# EAGLE design bridge (EAGLE 6.5.0)
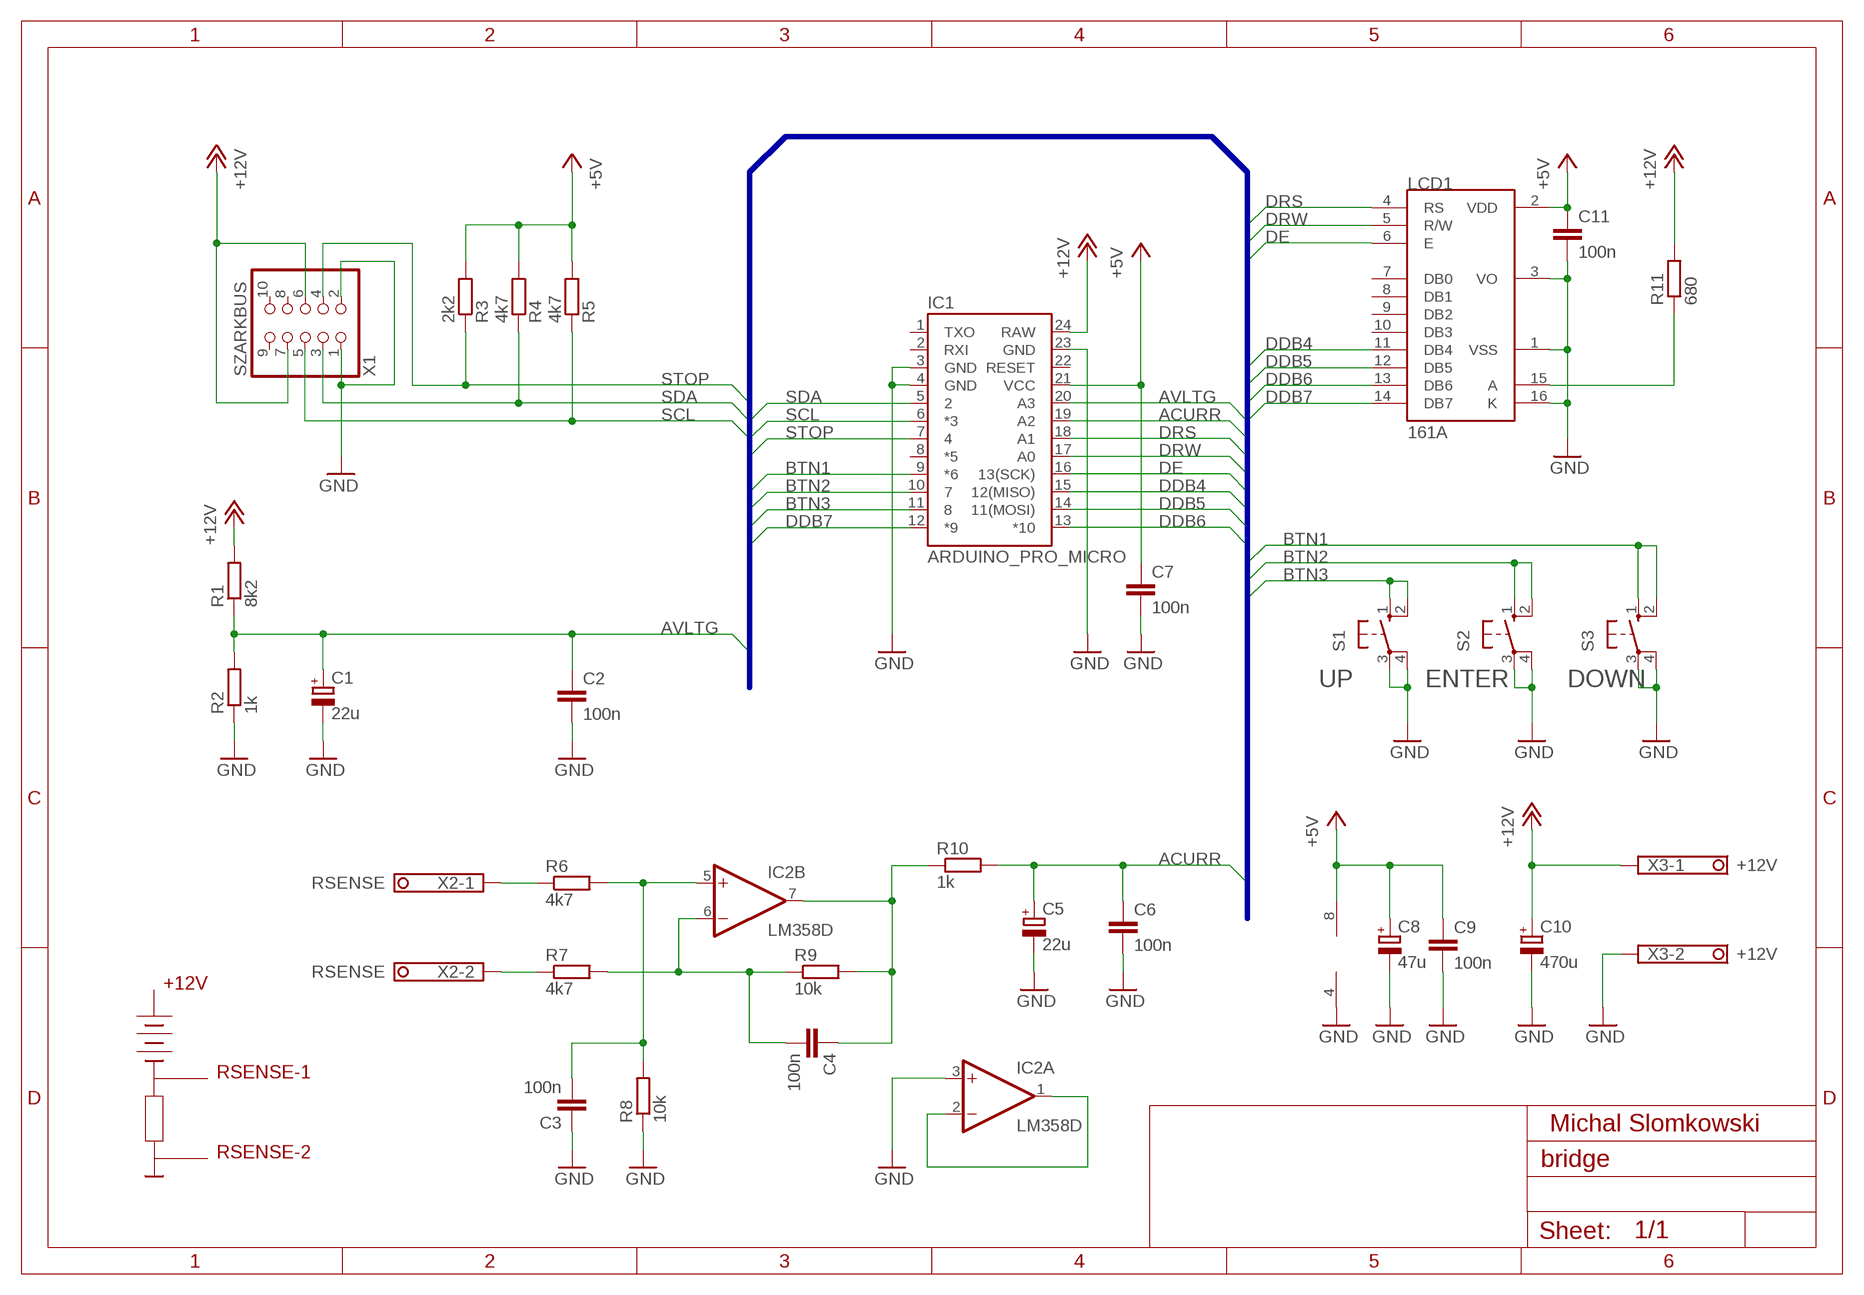
[diagram p0: schematic, sheet 1]

## Parts
C1  22u  CPOL-EUB/3528-21W  [B/3528-21W]
C2  100n  C-EUC1206  [C1206]
C3  100n  C-EUC1210  [C1210]
C4  100n  C-EUC1206  [C1206]
C5  22u  CPOL-EUB/3528-21W  [B/3528-21W]
C6  100n  C-EUC1206  [C1206]
C7  100n  C-EUC1206  [C1206]
C8  47u  CPOL-EUC/6032-28W  [C/6032-28W]
C9  100n  C-EUC1206  [C1206]
C10  470u  CPOL-EUE5-8.5  [E5-8,5]
C11  100n  C-EUC1206  [C1206]
IC1  ARDUINO_PRO_MICRO  [ARDUINO_PRO_MICRO]
IC2  LM358D  [SO08]
LCD1  161A  [161A]
R1  8k2  R-EU_M1206  [M1206]
R2  1k  R-EU_M1206  [M1206]
R3  2k2  R-EU_M1206  [M1206]
R4  4k7  R-EU_M1206  [M1206]
R5  4k7  R-EU_M1206  [M1206]
R6  4k7  R-EU_M1206  [M1206]
R7  4k7  R-EU_M1206  [M1206]
R8  10k  R-EU_M1206  [M1206]
R9  10k  R-EU_M1206  [M1206]
R10  1k  R-EU_M1206  [M1206]
R11  680  R-EU_0207/12  [0207/12]
S1  10-XX  [B3F-10XX]
S2  10-XX  [B3F-10XX]
S3  10-XX  [B3F-10XX]
X1  SZARKBUS  PINHD-2X5  [2X05]
X2  RSENSE  1751248  [1751248]
X3  +12V  1751248  [1751248]

## Nets
+5V: C7.1 C8.+ C9.1 C11.1 IC1.21(VCC) IC2.8(P:V+) LCD1.2(VDD) R3.2 R4.2 R5.2
+12V: C10.+ IC1.24(RAW) R1.2 R11.2 X1.6 X1.7 X3.1
ACURR: C5.+ C6.1 IC1.19(A2) R10.2
AVLTG: C1.+ C2.1 IC1.20(A3) R1.1 R2.2
BTN1: IC1.9(*6) S3.1(S) S3.2(S1)
BTN2: IC1.10 S2.1(S) S2.2(S1)
BTN3: IC1.11 S1.1(S) S1.2(S1)
DDB4: IC1.15(12(MISO)) LCD1.11(DB4)
DDB5: IC1.14(11(MOSI)) LCD1.12(DB5)
DDB6: IC1.13(*10) LCD1.13(DB6)
DDB7: IC1.12(*9) LCD1.14(DB7)
DE: IC1.16(13(SCK)) LCD1.6(E)
DRS: IC1.18(A1) LCD1.4(RS)
DRW: IC1.17(A0) LCD1.5(R/W)
GND: C1.- C2.2 C3.1 C5.- C6.2 C7.2 C8.- C9.2 C10.- C11.2 IC1.3(GND) IC1.4(GND) IC1.23(GND) IC2.3(A:+IN) IC2.4(P:V-) LCD1.1(VSS) LCD1.3(VO) LCD1.16(K) R2.1 R8.1 S1.3(P) S1.4(P1) S2.3(P) S2.4(P1) S3.3(P) S3.4(P1) X1.1 X1.2 X3.2
N$1: C3.2 IC2.5(B:+IN) R6.2 R8.2
N$2: LCD1.15(A) R11.1
N$4: C4.2 IC2.6(B:-IN) R7.2 R9.1
N$12: IC2.1(A:OUT) IC2.2(A:-IN)
N$21: R7.1 X2.2
N$29: R6.1 X2.1
NET3: C4.1 IC2.7(B:OUT) R9.2 R10.1
SCL: IC1.6(*3) R5.1 X1.5
SDA: IC1.5 R4.1 X1.3
STOP: IC1.7 R3.1 X1.4
Unconnected: IC1.1(TXO) IC1.2(RXI) IC1.8(*5) IC1.22(RESET) LCD1.7(DB0) LCD1.8(DB1) LCD1.9(DB2) LCD1.10(DB3) X1.8 X1.9 X1.10

## Buses
B$1

## Notes on the sheet
- UP | ENTER | DOWN
- +12V
- RSENSE-1
- Michal Slomkowski
- RSENSE-2

## Library data of the parts
C1 C5 C8 C10 = rcl:CPOL-EU: POLARIZED CAPACITOR, European symbol
C2-C4 C6 C7 C9 C11 = rcl:C-EU: CAPACITOR, European symbol
IC1 = sparkfun-boards:ARDUINO_PRO_MICRO
IC2 = linear:LM358: OP AMP also LM158; LM258; LM2904 Source: http://cache.national.com/ds/LM/LM158.pdf
LCD1 = robot:161A
R1-R11 = rcl:R-EU_: RESISTOR, European symbol
S1-S3 = switch-omron:10-XX: OMRON SWITCH; MPN: B3F-1000; OC_FARNELL: 176432; OC_NEWARK: 36M3542
X1 = pinhead:PINHD-2X5: PIN HEADER
X2 X3 = con-phoenix-350:1751248: MKDS 1/ 2-3,5 Printklemme Nennstrom: 10 A Bemessungsspannung: 160 V Raster: 3,5 mm Polzahl: 2 Montageart: Löten Anschlussart: Schraubanschluss Anschlussrichtung vom Leiter zur Platine: 0° Source: http://eshop.phoenixcontact.com .. 1751248.pdf; OC_FARNELL: unknown; OC_NEWARK: unknown

## Board
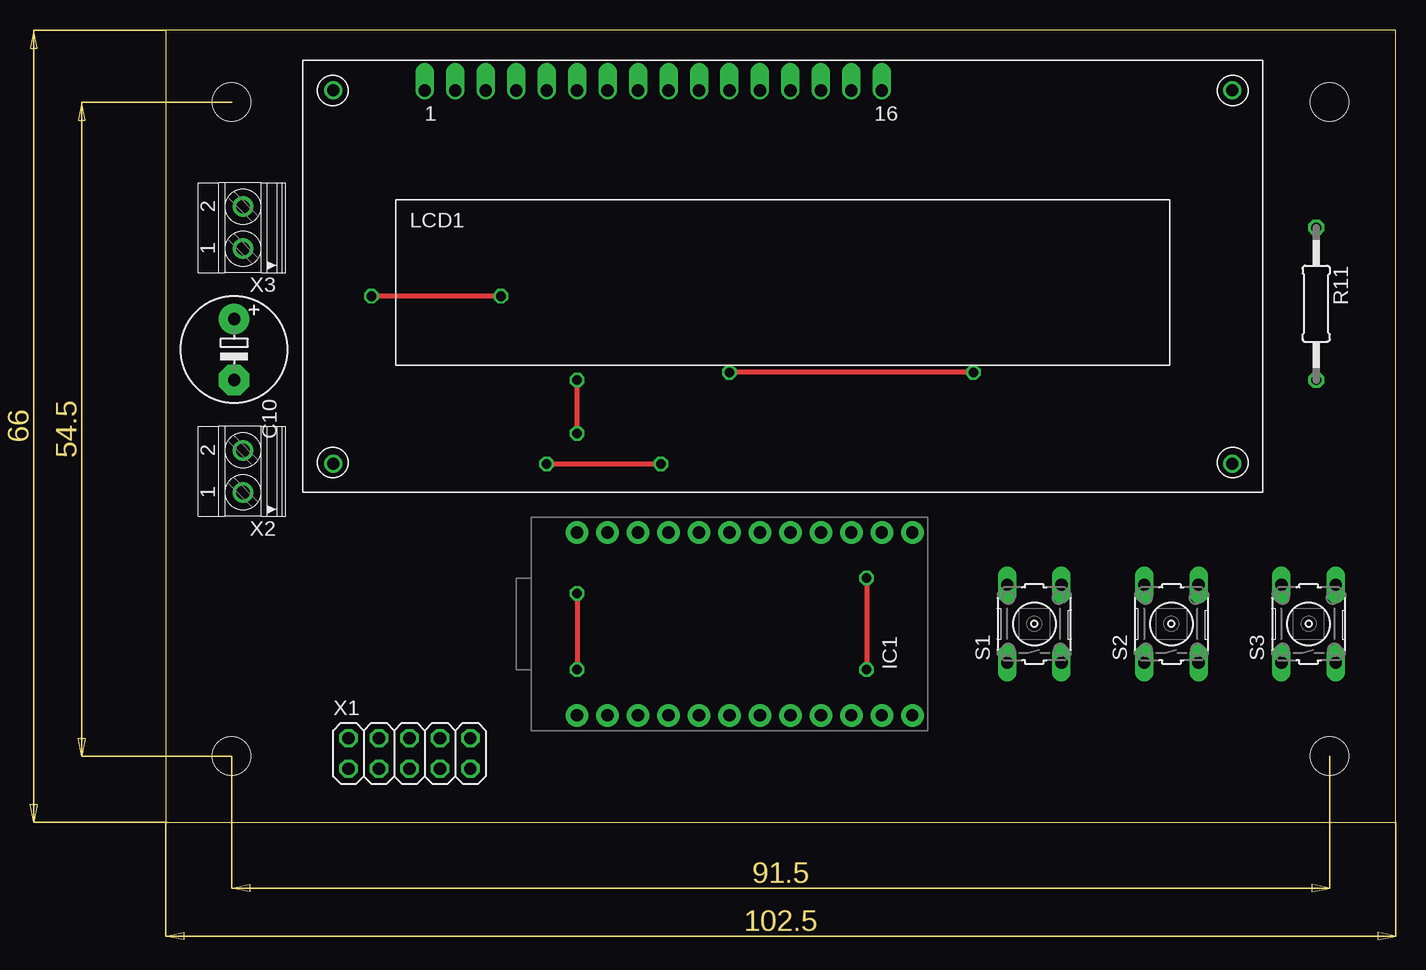
[diagram p1: board, top side]
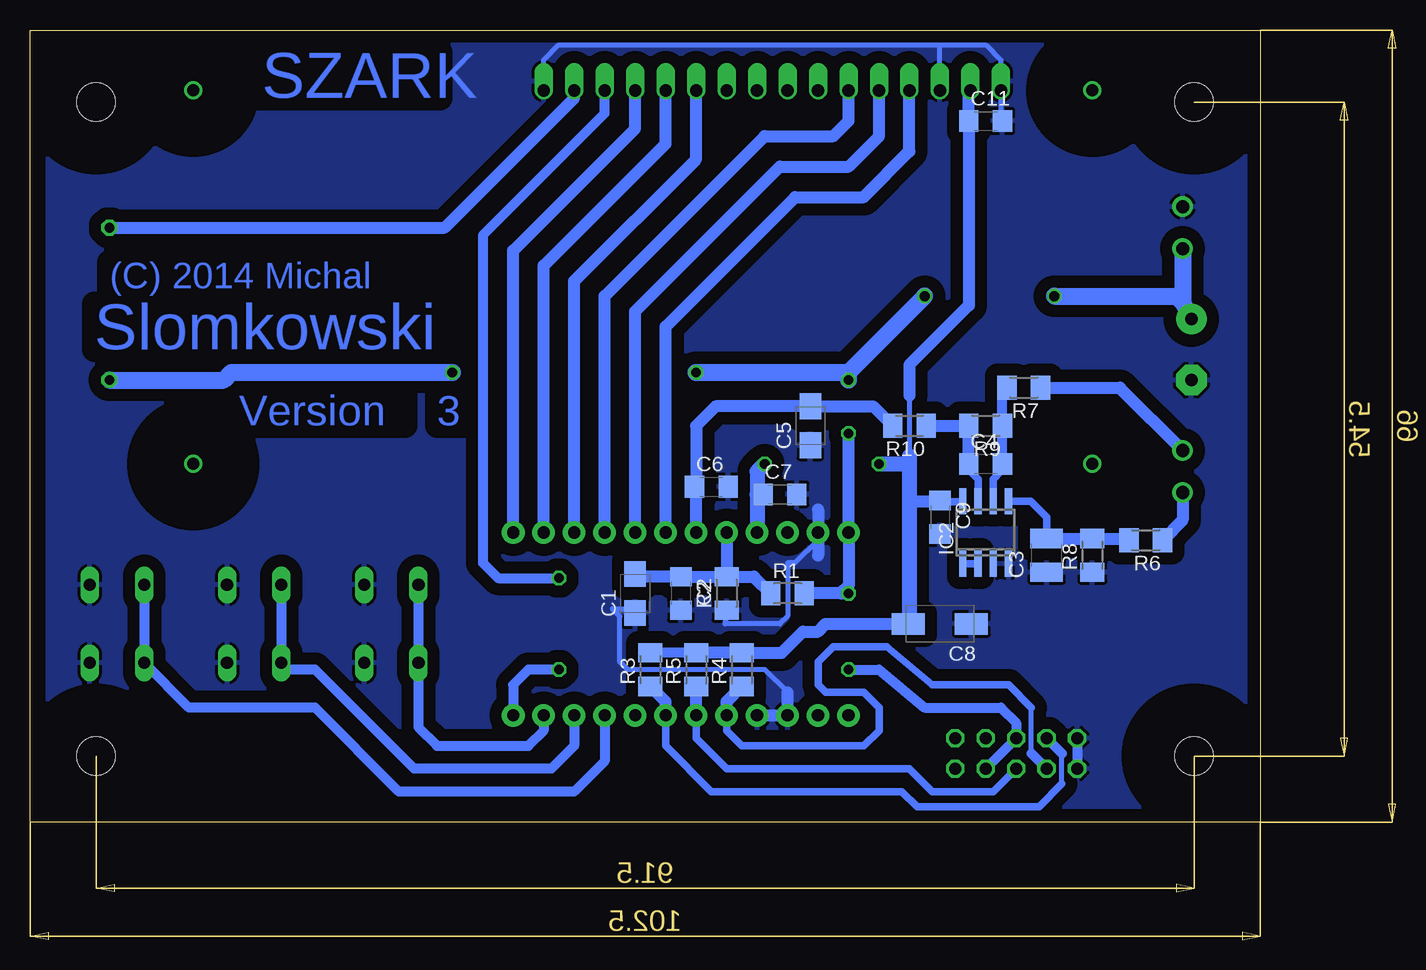
[diagram p2: board, bottom side, seen from below]

Size 102.5 x 66 mm. Coordinates in mm from the lower left corner, seen from the top.
Outline: 0,0 102.5,0 102.5,66 0,66 0,0
Copper layers (1*16): Top 0.035mm / dielectric 1.5mm / Bottom 0.035mm
Design rules "default": minimum track width 10mil, minimum drill 24mil, track to track 8mil, track to pad 8mil, pad to pad 8mil, via to via 8mil, smd to smd 8mil, copper to edge 40mil, drill to drill 8mil, minimum pad ring 10mil, minimum via ring 8mil, stop-mask expansion 4mil, vias tented up to drill 0mil, thermal gap 10mil
Holes 3.2 mm at 5.5,5.5 97,5.5 5.5,60 97,60
bRestrict: area 0.5,0.5 to 10.5,10.5; area 92,0.5 to 102,10.5; area 0.5,55 to 10.5,65; area 92,55 to 102,65; area 9.5,56.5 to 18.5,65.5; area 84.4,56.5 to 93.4,65.5; area 9.5,25.3 to 18.5,34.3; area 84.4,25.3 to 93.4,34.3

### Footprints (pad centres in the part's own frame; a part is rotated, then mirrored left to right if it is on the bottom)
B/3528-21W = smd 2.15 x 1.8: + 1.625,0; - -1.625,0
C1206 = smd 1.6 x 1.8: 1 -1.4,0; 2 1.4,0
C1210 = smd 1.6 x 2.7: 1 -1.4,0; 2 1.4,0
C/6032-28W = smd 2.75 x 1.8: + 2.625,0; - -2.625,0
E5-8,5 = drill 1.016 pad 2.54: + -2.54,0 | drill 1.016 pad 2.54 octagon: - 2.54,0
ARDUINO_PRO_MICRO = drill 1.016 pad 1.88: 1 -7.62,12.7; 2 -7.62,10.16; 3 -7.62,7.62; 4 -7.62,5.08; 5 -7.62,2.54; 6 -7.62,0; 7 -7.62,-2.54; 8 -7.62,-5.08; 9 -7.62,-7.62; 10 -7.62,-10.16; 11 -7.62,-12.7; 12 -7.62,-15.24; 13 7.62,-15.24; 14 7.62,-12.7; 15 7.62,-10.16; 16 7.62,-7.62; 17 7.62,-5.08; 18 7.62,-2.54; 19 7.62,0; 20 7.62,2.54; 21 7.62,5.08; 22 7.62,7.62; 23 7.62,10.16; 24 7.62,12.7
SO08 = smd 0.6 x 2.2: 1 -1.905,-2.6; 2 -0.635,-2.6; 3 0.635,-2.6; 4 1.905,-2.6; 5 1.905,2.6; 6 0.635,2.6; 7 -0.635,2.6; 8 -1.905,2.6
161A = drill 1.016 offset: 1 0,0; 2 2.54,0; 3 5.08,0; 4 7.62,0; 5 10.16,0; 6 12.7,0; 7 15.24,0; 8 17.78,0; 9 20.32,0; 10 22.86,0; 11 25.4,0; 12 27.94,0; 13 30.48,0; 14 33.02,0; 15 35.56,0; 16 38.1,0
M1206 = smd 1.6 x 2: 1 -1.4,0; 2 1.4,0
0207/12 = drill 0.813 octagon: 1 -6.35,0; 2 6.35,0
B3F-10XX = drill 1.016 long: 1 -3.251,2.261; 2 3.251,2.261; 3 -3.251,-2.261; 4 3.251,-2.261
2X05 = drill 1.016 octagon: 1 -5.08,-1.27; 2 -5.08,1.27; 3 -2.54,-1.27; 4 -2.54,1.27; 5 0,-1.27; 6 0,1.27; 7 2.54,-1.27; 8 2.54,1.27; 9 5.08,-1.27; 10 5.08,1.27
1751248 = drill 1.1 pad 1.7: 1 -1.75,-0.1; 2 1.75,-0.1

### Placement (x,y rotation side)
C1  52.07,19.05 90 bottom
C2  48.26,19.05 270 bottom
C3  17.78,22.23 90 bottom
C4  22.86,29.84 0 bottom
C5  37.47,33.02 90 bottom
C6  45.72,27.94 0 bottom
C7  40.01,27.3 0 bottom
C8  26.67,16.51 180 bottom
C9  26.67,25.4 270 bottom
C10  5.71,39.37 270 top
C11  22.86,58.42 0 bottom
IC1  46.99,16.51 90 top
IC2  22.86,24.13 0 bottom
LCD1  21.59,60.96 0 top
R1  39.37,19.05 0 bottom
R2  44.45,19.05 90 bottom
R3  50.8,12.7 90 bottom
R4  43.18,12.7 90 bottom
R5  46.99,12.7 90 bottom
R6  9.53,23.5 180 bottom
R7  19.68,36.2 180 bottom
R8  13.97,22.23 90 bottom
R9  22.86,33.02 180 bottom
R10  29.21,33.02 180 bottom
R11  95.89,43.18 270 top
S1  72.39,16.51 90 top
S2  83.82,16.51 90 top
S3  95.25,16.51 90 top
X1  20.32,5.71 0 top
X2  6.35,29.21 90 top
X3  6.35,49.53 90 top

### Tracks (layer width: path | path; a pad name or v marks a point on that pad's centre or on a via)
+5V  (via drill 0.8)
  Top 0.406: v31.75,29.84 v41.27,29.84
  Bottom 0.406: C11.1 24.13,58.42 | 29.21,35.56 29.21,30.48
  Bottom 0.61: C9.1 26.54,26.67 24.77,26.67 IC2.8
  Bottom 0.813: R5.2 R3.2
  Bottom 1.016: R5.2 R4.2 39.88,14.1 38.1,15.88 36.83,15.88 36.2,16.51 C8.+ | C9.1 26.8,26.67 29.21,26.67 | 29.21,35.56 29.21,38.1 24.26,43.05 C11.1 24.26,60.83 LCD1.2 | C7.1 41.91,27.3
  Bottom 1.27: v41.27,29.84 41.91,29.21 41.91,27.3 IC1.21 | 29.21,30.48 29.21,29.84 | 29.21,29.84 29.21,26.67 29.21,16.59 C8.+ | v31.75,29.84 29.21,29.84
+12V  (via drill 0.8)
  Top 0.406: v34.29,19.05 v34.29,12.7 | v27.94,43.81 v17.14,43.81 | v34.29,32.38 v34.29,36.83 | v67.31,37.47 v46.99,37.47
  Bottom 0.813: X1.7 X1.6 20.32,8.26 21.59,9.53 27.94,9.53 31.75,12.7 v34.29,12.7
  Bottom 1.016: 34.92,19.05 34.29,19.68 IC1.24 v34.29,32.38 | 34.92,19.05 v34.29,19.05 | 34.92,19.05 R1.2
  Bottom 1.422: X3.1 6.45,43.28 | 6.45,43.28 C10.+ | v17.14,43.81 6.99,43.81 6.45,43.28 | v34.29,36.83 34.29,37.47 | v27.94,43.81 34.29,37.47 | v67.31,37.47 85.72,37.47 86.36,36.83 R11.2 | v46.99,37.47 34.29,37.47
ACURR
  Bottom 1.016: IC1.19 46.99,27.81 C6.1 46.99,28.07 46.99,33.02 45.37,34.65 C5.+ 32.23,34.65 R10.2
AVLTG
  Bottom 1.016: IC1.20 R2.2 | R2.2 C2.1 51.84,20.45 C1.+ | R2.2 42.17,20.45 R1.1
BTN1
  Bottom 0.813: IC1.9 54.61,5.08 57.15,2.54 71.75,2.54 78.74,9.53 89.26,9.53 S3.1 S3.2
BTN2
  Bottom 0.813: S2.2 S2.1 81,12.7 78.74,12.7 70.48,4.45 59.05,4.45 57.15,6.35 IC1.10
BTN3
  Bottom 0.813: S1.2 S1.1 70.13,7.9 68.58,6.35 60.96,6.35 59.69,7.62 IC1.11
DDB4
  Bottom 1.016: IC1.15 57.15,45.09 46.99,55.24 LCD1.11
DDB5
  Bottom 1.016: IC1.14 59.69,46.35 49.53,56.52 LCD1.12
DDB6
  Bottom 1.016: IC1.13 62.23,47.62 52.07,57.78 LCD1.13
DDB7  (via drill 0.8)
  Top 0.406: v58.42,20.32 v58.42,12.7
  Bottom 0.813: v58.42,20.32 63.5,20.32 64.77,21.59 64.77,48.9 54.61,59.05 LCD1.14 | v58.42,12.7 60.96,12.7 62.23,11.43 IC1.12
DE
  Bottom 1.016: IC1.16 54.61,43.81 41.27,57.15 35.56,57.15 34.29,58.42 LCD1.6
DRS
  Bottom 1.016: IC1.18 49.53,41.27 38.73,52.07 33.02,52.07 29.21,55.88 LCD1.4
DRW
  Bottom 1.016: IC1.17 52.07,42.55 40.01,54.61 34.29,54.61 31.75,57.15 LCD1.5
GND
  Bottom 0.406: LCD1.16 59.69,63.5 58.42,64.77 26.67,64.77 | 26.67,64.77 22.86,64.77 21.59,63.5 LCD1.1 21.59,58.55 C11.2 | LCD1.3 26.67,64.77 | IC1.23 36.83,23.5 38.73,21.59 39.37,21.59 39.37,17.14 40.01,16.51 44.58,16.51 R2.1 | 39.37,10.79 41.27,12.7 52.7,12.7 53.34,13.34 53.34,17.14 53.98,17.78 52.42,17.78 C1.-
  Bottom 0.813: X1.2 X1.1
  Bottom 1.016: IC1.4 IC1.3 39.37,10.79 | 36.83,26.04 36.83,22.23
  pour Bottom (isolate 1.016): 1.27,65.41 1.27,1.27 100.97,1.27 100.97,65.41
N$1
  Bottom 0.61: IC2.5 19.11,26.73 17.78,25.4 C3.2
  Bottom 1.016: R6.2 11.05,23.62 R8.2 C3.2
N$2
  Bottom 1.016: R11.1 67.94,49.53 57.15,60.33 LCD1.15
N$3  (via drill 1)
  other vias: 5.5,5.5
N$4
  Bottom 0.61: IC2.6 22.23,28.57 21.59,29.21 21.59,29.71 C4.2
  Bottom 0.813: C4.2 R9.1 21.46,35.82 R7.2
N$5  (via drill 1)
  other vias: 97,5.5
N$6  (via drill 1)
  other vias: 5.5,60
N$7  (via drill 1)
  other vias: 97,60
N$8  (via drill 1)
  other vias: 88.9,29.84
N$9  (via drill 1)
  other vias: 13.97,29.84
N$10  (via drill 1)
  other vias: 13.97,60.96
N$11  (via drill 1)
  other vias: 88.9,60.96
N$12
  Bottom 0.61: IC2.1 IC2.2
N$21
  Bottom 1.016: R7.1 11.69,36.2 X2.2
N$29
  Bottom 1.016: X2.1 6.45,25.17 R6.1
NET3
  Bottom 0.61: IC2.7 23.5,28.57 24.13,29.21 24.13,29.71 C4.1
  Bottom 1.016: R10.1 R9.2 C4.1
SCL
  Bottom 0.61: X1.5 22.23,2.54 27.3,2.54 29.21,4.45 44.45,4.45 46.99,6.99 IC1.6
  Bottom 1.016: IC1.6 R5.1
SDA
  Bottom 0.406: 19.05,5.71 19.05,9.53
  Bottom 0.61: 19.05,9.53 20.95,11.43 27.3,11.43 31.11,14.61 35.56,14.61 36.83,13.34 36.83,11.43 36.2,10.79 33.02,10.79 31.75,9.53 31.75,7.62 33.02,6.35 43.18,6.35 44.45,7.62 IC1.5
  Bottom 0.813: 19.05,5.71 X1.3
  Bottom 1.016: IC1.5 44.45,10.03 R4.1
STOP
  Bottom 0.406: 16.51,3.17 16.51,5.71
  Bottom 0.61: IC1.7 49.53,6.35 45.72,2.54 29.84,2.54 28.57,1.27 18.41,1.27 16.51,3.17
  Bottom 0.813: X1.4 16.51,5.71
  Bottom 1.016: IC1.7 49.53,10.03 R3.1

### Text on the board
Bottom: SZARK | (C) 2014 Michal | Slomkowski | 3 | Version